# EAGLE design h-bridge (EAGLE 6.4)
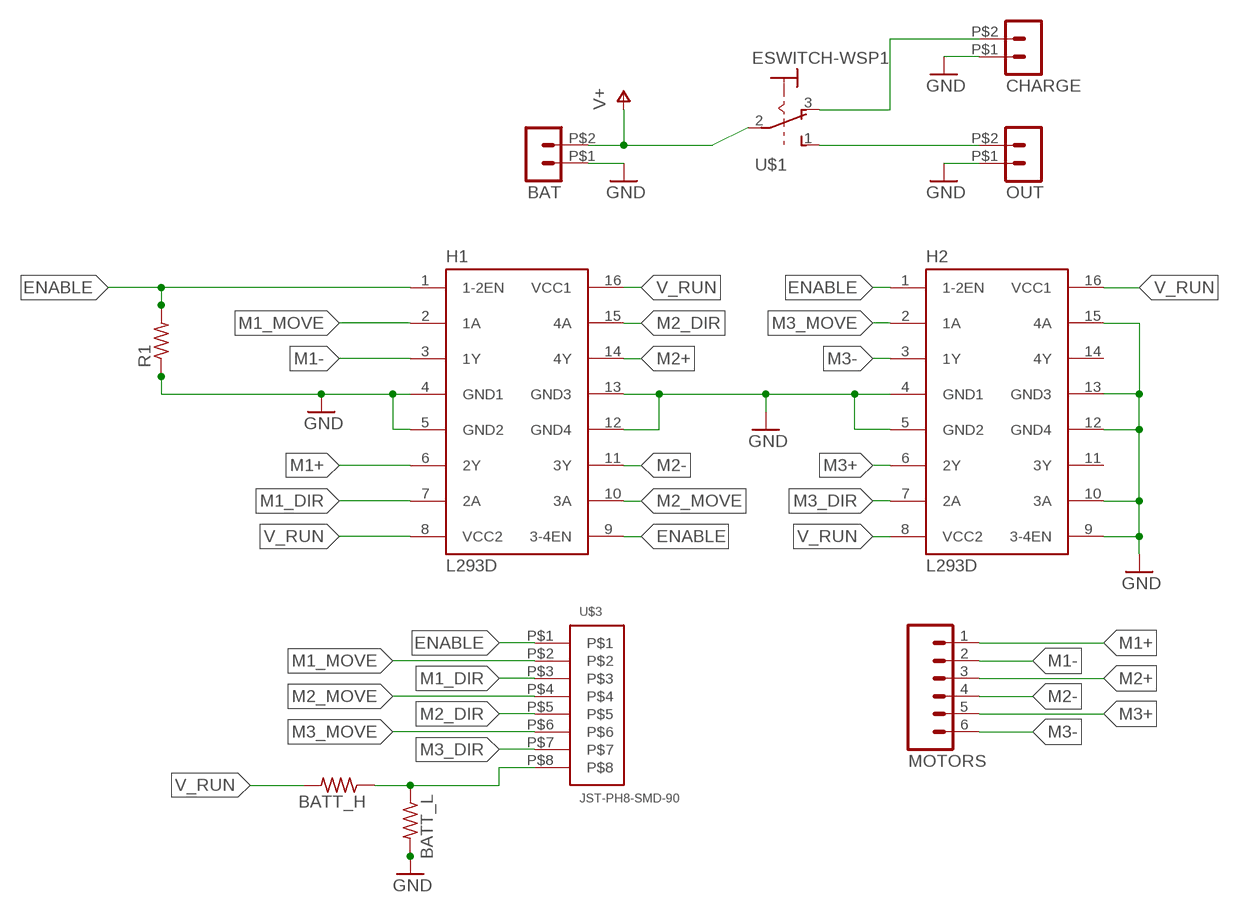
[diagram p0: schematic, sheet 1]

## Parts
BAT  HEADER_POS2_43045-0206  [43045-0206]
BATT_H  R-US_R0603  [R0603]
BATT_L  R-US_R0603  [R0603]
CHARGE  HEADER_POS2_43045-0206  [43045-0206]
H1  L293D  [DIL16]
H2  L293D  [DIL16]
MOTORS  M06LOCK  [1X06_LOCK]
OUT  HEADER_POS2_43045-0206  [43045-0206]
R1  R-US_R0603  [R0603]
U$1  ESWITCH-WSP1  [WSP1-T2-M6]
U$3  JST-PH8-SMD-90  [JST-PH-SMD-90*]

## Nets
ENABLE: H1.1(1-2EN) H1.9(3-4EN) H2.1(1-2EN) R1.2 U$3.P$1
GND [power]: BAT.P$1 BATT_L.2 CHARGE.P$1 H1.4(GND1) H1.5(GND2) H1.12(GND4) H1.13(GND3) H2.4(GND1) H2.5(GND2) H2.9(3-4EN) H2.10(3A) H2.12(GND4) H2.13(GND3) H2.15(4A) OUT.P$1 R1.1
M1+ [power]: H1.6(2Y) MOTORS.1
M1- [power]: H1.3(1Y) MOTORS.2
M1_DIR: H1.7(2A) U$3.P$3
M1_MOVE: H1.2(1A) U$3.P$2
M2+ [power]: H1.14(4Y) MOTORS.3
M2- [power]: H1.11(3Y) MOTORS.4
M2_DIR: H1.15(4A) U$3.P$5
M2_MOVE: H1.10(3A) U$3.P$4
M3+ [power]: H2.6(2Y) MOTORS.5
M3- [power]: H2.3(1Y) MOTORS.6
M3_DIR: H2.7(2A) U$3.P$7
M3_MOVE: H2.2(1A) U$3.P$6
N$2: BATT_H.1 BATT_L.1 U$3.P$8
V+ [power]: BAT.P$2 U$1.2
V_CHARGE [power]: CHARGE.P$2 U$1.3
V_RUN [power]: BATT_H.2 H1.8(VCC2) H1.16(VCC1) H2.8(VCC2) H2.16(VCC1) OUT.P$2 U$1.1
Unconnected: H2.11(3Y) H2.14(4Y)

## Library data of the parts
BAT CHARGE OUT = con-molex-micro-fit-3_0:HEADER_POS2_?: Molex - Micro-Fit 3.0 Series connector, 3.00mm (0.118") pitch header, 2 positions.
BATT_H BATT_L R1 = resistor:R-US_: RESISTOR, American symbol
H1 H2 = st-microelectronics:L293D: PUSH-PULL 4 CHANNEL DRIVER; MPN: L293D; OC_FARNELL: 9589619; OC_NEWARK: 56P8249
MOTORS = SparkFun-Connectors:M06: Header 6 Standard 6-pin 0.1" header. Use with straight break away headers (SKU : PRT-00116), right angle break away headers (PRT-00553), swiss pins (PRT-00743), machine pins (PRT-00117), and female headers (PRT-00115). Molex polarized connector foot print use with SKU : PRT-08094 with associated crimp pins and housings. NOTES ON THE VARIANTS LOCK and LOCK_LONGPADS... This footprint was designed to help hold the alignment of a through-hole component (i.e. 6-pin header) while soldering it into place. You may notice that each hole has been shifted either up or down by 0.005 of an inch from it's more standard position (which is a perfectly straight line). This slight alteration caused the pins (the squares in the middle) to touch the edges of the holes. Because they are alternating, it causes a "brace" to hold the component in place. 0.005 has proven to be the perfect amount of "off-center" position when using our standard breakaway headers. Although looks a little odd when you look at the bare footprint, once you have a header in there, the alteration is very hard to notice. Also, if you push a header all the way into place, it is covered up entirely on the bottom side. This idea of altering the position of holes to aid alignment will be further integrated into the Sparkfun Library for other footprints. It can help hold any component with 3 or more connection pins.
U$1 = wolfbot:ESWITCH-WSP1: Toggle Switch
U$3 = jst-ph:JST-PH8-SMD-90*: JSTs PH connector with 8 pins, right angle smd form http://www.jst-mfg.com/product/pdf/eng/ePH.pdf

## Net classes
0 default: width 0.254 mm, drill 0.508 mm, clearance 0.254 mm
1 power: width 0.508 mm, drill 0.508 mm, clearance 0.508 mm to class 0, clearance 0.508 mm

## Board
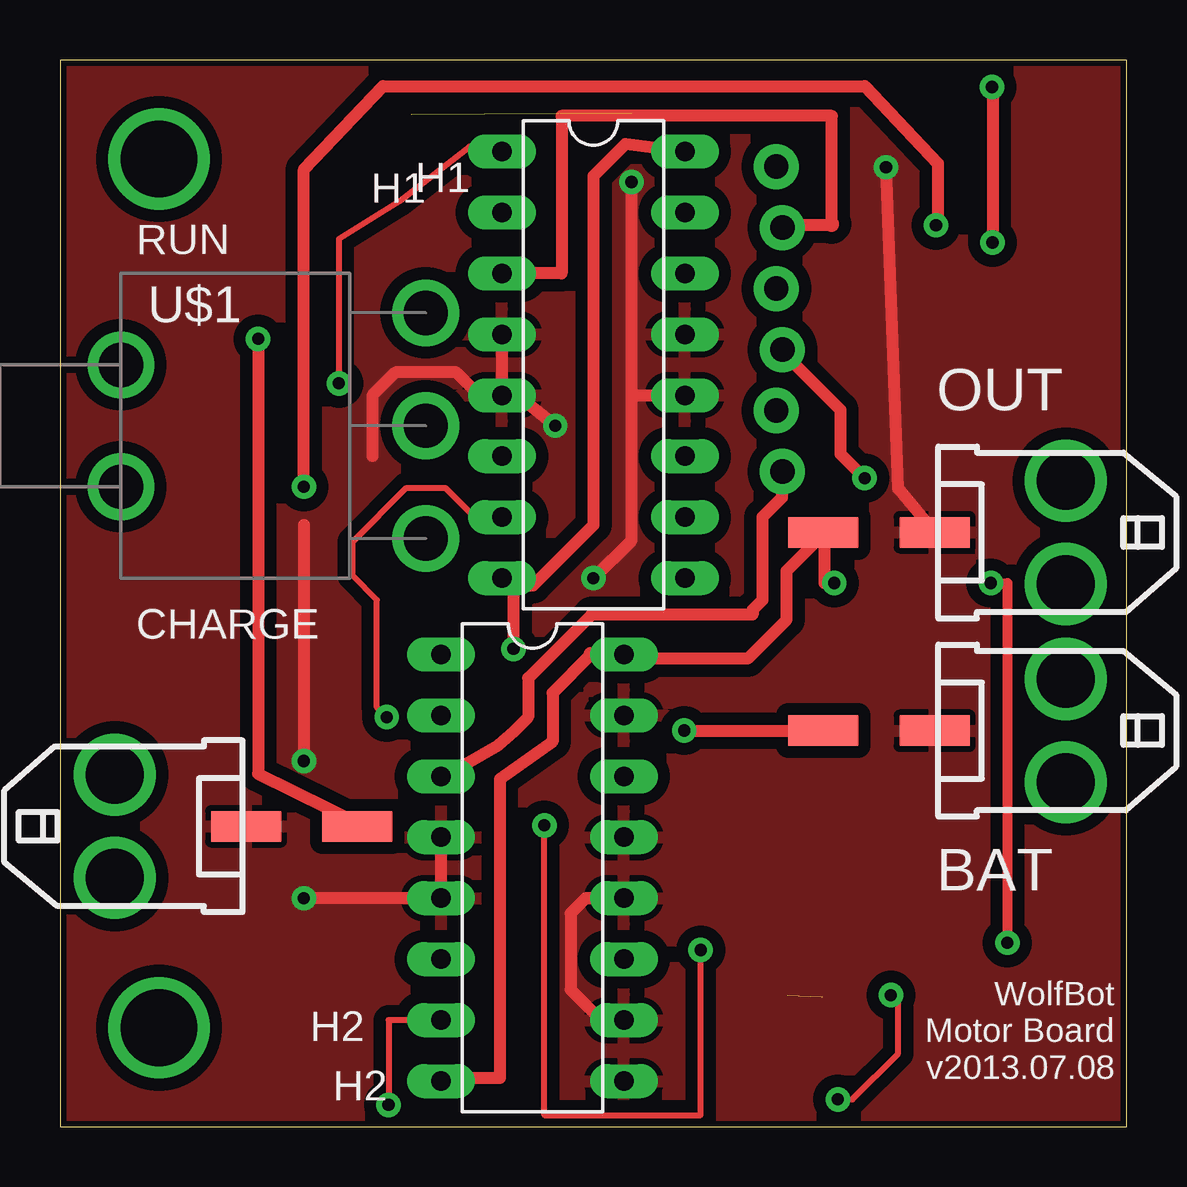
[diagram p1: board, top side]
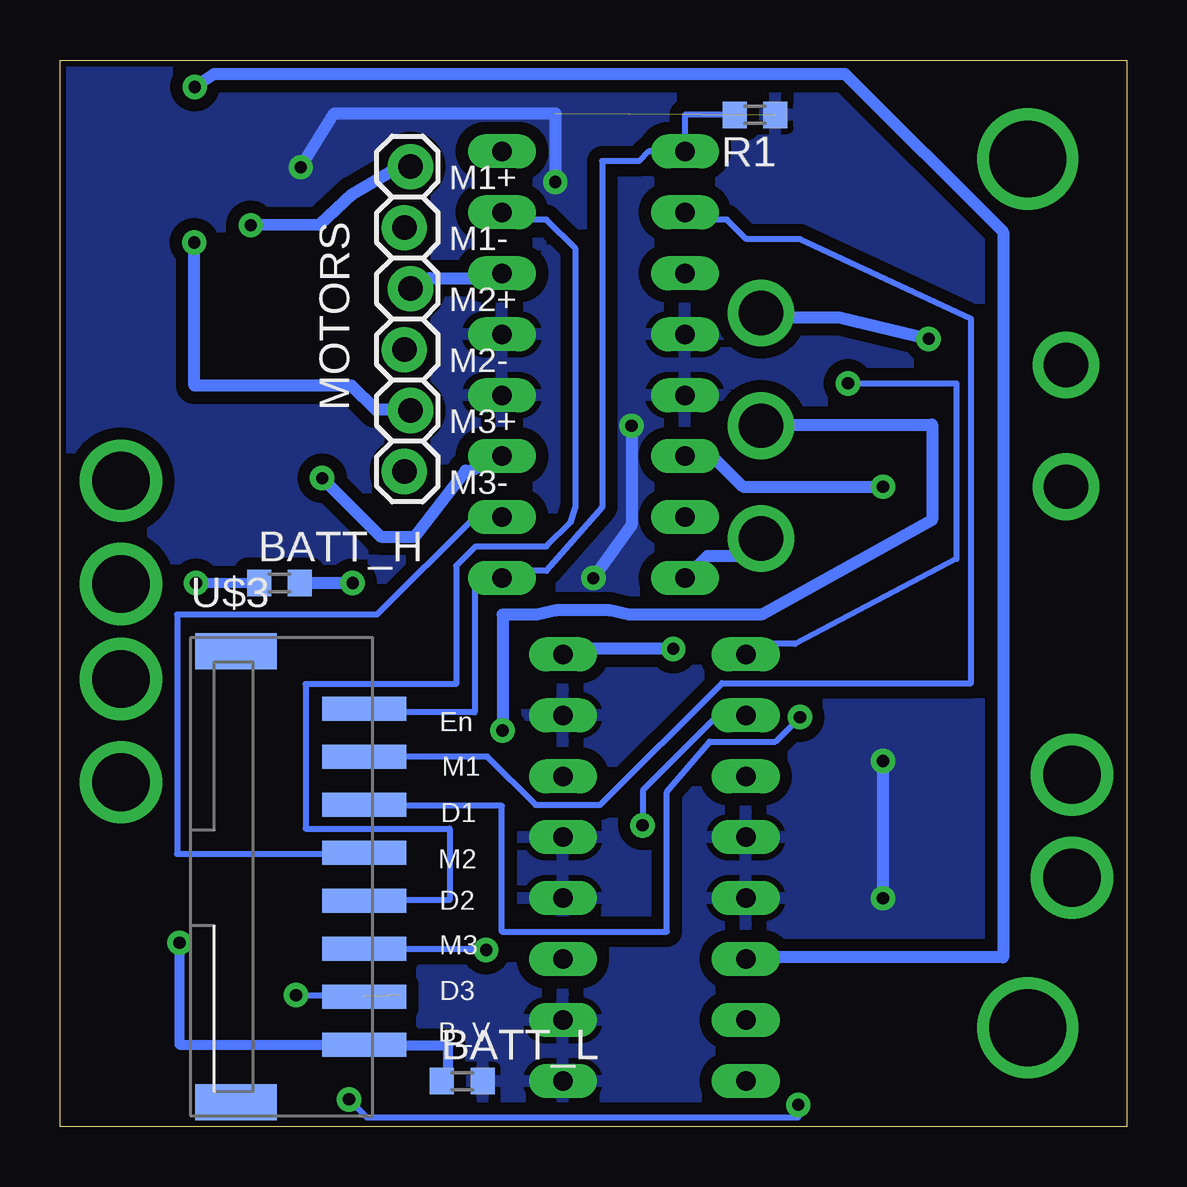
[diagram p2: board, bottom side, seen from below]

Size 44.45 x 44.45 mm. Coordinates in mm from the lower left corner, seen from the top.
Outline: 0,0 44.45,0 44.45,44.45 0,44.45 0,0
Copper layers (1*16): Top 0.035mm / dielectric 1.5mm / Bottom 0.035mm
Design rules "SparkFun": minimum track width 8mil, minimum drill 20mil, track to track 8mil, track to pad 8mil, pad to pad 8mil, via to via 8mil, smd to smd 8mil, copper to edge 10mil, drill to drill 8mil, minimum pad ring 12mil, minimum via ring 10mil, stop-mask expansion 4mil, vias tented up to drill 25mil, thermal gap 10mil

### Footprints (pad centres in the part's own frame; a part is rotated, then mirrored left to right if it is on the bottom)
43045-0206 = smd 1.27 x 2.92: P$1 0,5.47; P$2 0,10.1 | drill 2.41: P$3 -2.15,0; P$4 2.15,0
R0603 = smd 1 x 1.1: 1 -0.85,0; 2 0.85,0
DIL16 = drill 0.813 long: 1 -8.89,-3.81; 2 -6.35,-3.81; 3 -3.81,-3.81; 4 -1.27,-3.81; 5 1.27,-3.81; 6 3.81,-3.81; 7 6.35,-3.81; 8 8.89,-3.81; 9 8.89,3.81; 10 6.35,3.81; 11 3.81,3.81; 12 1.27,3.81; 13 -1.27,3.81; 14 -3.81,3.81; 15 -6.35,3.81; 16 -8.89,3.81
1X06_LOCK = drill 1.016 pad 1.88: 1 0,0; 2 2.54,-0.254; 3 5.08,0; 4 7.62,-0.254; 5 10.16,0; 6 12.7,-0.254
WSP1-T2-M6 = drill 1.85 pad 2.54: 1 12.7,-4.699; 2 12.7,0; 3 12.7,4.699; B1 0,2.54; B2 0,-2.54
JST-PH-SMD-90* = smd 1 x 3.5: P$1 2.95,7.25; P$2 4.95,7.25; P$3 6.95,7.25; P$4 8.95,7.25; P$5 10.95,7.25; P$6 12.95,7.25; P$7 14.95,7.25; P$8 16.95,7.25 | smd 1.5 x 3.4: P$9 0.55,1.9; P$10 19.35,1.9

### Placement (x,y rotation side)
BAT  41.91,16.51 90 top
BATT_H  35.31,22.66 0 bottom
BATT_L  27.69,1.91 0 bottom
CHARGE  2.29,12.52 270 top
H1  22.23,31.75 270 top
H2  19.68,10.79 270 top
MOTORS  29.84,40.01 270 bottom
OUT  41.91,24.77 90 top
R1  15.49,42.16 180 bottom
U$1  2.54,29.21 0 top
U$3  39.01,20.37 270 bottom

### Tracks (layer width: path | path; a pad name or v marks a point on that pad's centre or on a via)
ENABLE  (via drill 0.51)
  Top 0.254: v11.62,30.98 11.62,36.98 14.16,38.57 17.07,40.84 18.29,40.84 18.29,40.64 H1.1
  Bottom 0.254: H2.1 15.44,20.12 13.82,20.12 7.1,23.66 7.1,30.98 v11.62,30.98 | R1.2 18.41,42.16 H1.1 19.91,40.64 20.32,40.23 21.86,40.23 21.86,25.81 24.18,23.16 25.81,23.16 26.01,22.96 H1.9 27.18,22.86 27.18,17.27 30.3,17.27 U$3.P$1
GND  (via drill 0.51)  (1 unrouted)
  Top 0.508: 17.78,30.48 H1.5 19.05,30.48 v20.64,29.21 | 17.78,30.48 17.46,30.48 16.51,31.43 13.97,31.43 13.02,30.48 13.02,27.94 | 10.16,25.08 v10.16,15.24 | 10.16,9.41 v10.16,9.53 H2.5 H2.4 | H1.4 18.41,31.11 17.78,30.48 | v22.23,22.86 23.81,24.45 23.81,30.48 | 23.81,30.48 H1.12 | H2.12 21.91,9.53 21.27,8.89 21.27,5.71 22.54,4.45 H2.10 | 23.81,30.48 v23.81,39.37 | OUT.P$1 34.92,26.6 v34.42,39.98
  Bottom 0.508: v10.16,15.24 v10.16,9.53 | v20.64,29.21 20.64,25.08 v22.23,22.86 | v34.42,39.98 33.02,42.23 23.81,42.23 v23.81,39.37 | 22.76,4.45 22.76,4.27 H2.10
  pour Top: -4.45,48.26 -4.13,-4.13 48.26,-2.54 48.26,48.26
  pour Bottom: -2.54,45.72 -2.54,-2.54 45.4,-0.95 45.72,45.72
M1+  (via drill 0.51)
  Top 0.508: v10.16,26.67 10.16,39.88 13.46,43.36 33.53,43.36 36.58,40.13 36.58,37.64
  Top 0.61: 36.58,37.64 v36.5,37.57
  Bottom 0.508: v36.5,37.57 33.63,37.58 32.27,38.85 30.28,40.03 29.87,40.03 MOTORS.1 | 17.27,27.94 16,26.67 v10.16,26.67
  Bottom 0.61: H1.6 17.27,27.94
M1-
  Top 0.508: H1.3 20.9,35.56 20.9,42.13 32.16,42.13 32.16,37.62 | 30.28,37.59 32.15,37.59
  Top 0.61: 32.15,37.59 32.16,37.62 | MOTORS.2 30.15,37.47 30.28,37.59
M1_DIR  (via drill 0.51)
  Top 0.254: H1.7 17.27,25.4 16.05,26.62 14.43,26.62 12.19,24.38 12.19,22.96 13.21,21.95 13.21,17.48 v13.61,17.07
  Bottom 0.254: v13.61,17.07 14.63,16.05 17.39,16.05 19.16,13.96 19.16,8.13 26.04,8.13 26.04,13.37 31.76,13.37 U$3.P$3
M1_MOVE
  Bottom 0.254: H1.2 18.29,38 18.09,37.8 16.66,37.8 15.85,36.98 13.61,36.98 6.49,33.67 6.49,18.49 16.87,18.49 21.95,13.41 24.64,13.41 26.64,15.42 U$3.P$2
M2+
  Bottom 0.508: H1.14 26.21,35.56 26.42,35.36 29.06,35.36 29.46,34.95 29.67,34.95 MOTORS.3
M2-  (via drill 0.51)
  Top 0.508: v33.53,27.03 32.51,28.04 32.51,29.87 30.28,32.11 30.28,32.31 MOTORS.4
  Bottom 0.508: v33.53,27.03 31.09,24.59 29.67,24.59 27.55,27.34 27.34,27.34 26.21,27.84 H1.11
M2_DIR
  Bottom 0.254: H1.15 26.01,38 25.81,37.8 24.18,37.8 22.96,36.58 22.96,25.83 23.16,25.2 24.18,24.18 27.13,24.18 27.94,23.37 27.94,18.44 34.21,18.44 34.21,12.42 28.22,12.42 28.22,9.45 31.76,9.45 U$3.P$5
M2_MOVE
  Bottom 0.254: H1.10 27.18,25.4 31.24,21.34 39.57,21.34 39.57,11.37 31.76,11.37 U$3.P$4
M3+  (via drill 0.51)
  Top 0.508: v38.84,43.33 38.86,43.41 38.86,42.95 v38.86,36.84 | v38.84,43.33 38.84,43.28 | v38.84,43.33 38.86,43
  Top 0.61: 38.86,43 38.86,43.41
  Bottom 0.508: v38.86,36.84 38.86,30.89 32.31,30.89 31.29,29.87 29.87,29.87 MOTORS.5 | H2.6 15.85,7.11 15.9,7.06 5.16,7.06 5.16,37.29 11.73,43.86 37.52,43.87 38.02,43.87 38.02,43.86 v38.84,43.33
M3-
  Top 0.508: H2.3 16.05,14.63 18.26,15.9 18.9,16.46 19.51,17.07 19.51,18.69 22.15,21.34 28.85,21.34 28.85,21.54 29.26,21.95 29.26,25.4 30.07,26.21 30.07,27.23 MOTORS.6
M3_DIR  (via drill 0.51)  (1 unrouted)
  Top 0.254: H2.7 13.69,4.45 v13.69,0.91 | v32.41,1.14 33.02,1.14 34.92,3.05 34.92,5.18 v34.62,5.49
  Bottom 0.254: v34.62,5.49 30.3,5.49 | v13.69,0.91 13.69,0.38 31.65,0.38 v32.41,1.14
M3_MOVE  (via drill 0.51)
  Top 0.254: v20.18,12.56 20.18,0.48 26.7,0.48 v26.7,7.37
  Bottom 0.254: 30.3,7.37 31.25,7.4 | 31.25,7.4 U$3.P$6 | H2.2 17.04,17.14 20.17,14.02 20.17,12.57 v20.18,12.56 | 26.7,7.4 31.25,7.4
  Bottom 0.406: v26.7,7.37 26.7,7.4
N$1  (via drill 3.2)
  other vias: 4.13,4.13 4.13,40.32
N$2  (via drill 0.51)
  Top 0.406: v38.79,22.66 39.47,22.66 v39.47,7.67
  Bottom 0.254: 30.23,3.3 31.25,3.38 U$3.P$8
  Bottom 0.406: BATT_L.1 28.27,1.91 28.27,3.38 31.25,3.38 | 31.76,3.67 U$3.P$8 39.47,3.42 v39.47,7.67 | BATT_H.1 v38.79,22.66
V+  (via drill 0.51)
  Top 0.508: v26.01,16.51 31.85,16.51 31.7,16.66 BAT.P$2
  Bottom 0.508: v26.01,16.51 26.01,21.34 24.59,21.34 23.77,21.51 21.54,21.51 20.73,21.34 15.24,21.34 8.12,25.29 8.12,29.26 15.24,29.26 U$1.2
V_CHARGE  (via drill 0.51)
  Top 0.508: v8.26,32.83 8.26,14.72 12.62,12.57 CHARGE.P$2
  Bottom 0.508: v8.26,32.83 11.99,33.73 15.24,33.73 U$1.3
V_RUN  (via drill 0.51)
  Top 0.508: H1.16 23.57,40.96 22.24,39.62 22.24,25.08 19.71,22.55 18.49,22.55 18.49,22.76 H1.8 18.9,22.35 v18.9,19.91 | H2.8 16.05,2.03 18.33,2.03 18.33,14.49 20.52,16.05 20.52,18.09 22.12,19.68 | 23.5,19.51 28.65,19.51 30.28,21.13 30.28,23.16 31.7,24.59 OUT.P$2 31.85,24.77 31.85,22.66 v32.26,22.66
  Top 0.61: 23.5,19.51 H2.16 22.12,19.68
  Bottom 0.508: H1.8 18.29,22.96 17.48,23.77 15.85,23.77 15.24,24.38 U$1.1 | v18.9,19.91 23.27,19.91 H2.16 | v32.26,22.66 BATT_H.2

### Text on the board
tPlace: H1 | RUN | OUT | CHARGE | BAT | WolfBot / Motor Board / v2013.07.08 | H2
bPlace: M1+ | M1- | M2+ | M2- | M3+ | M3- | En | M1 | D1 | M2 | D2 | M3 | D3 | B_V